# Altium schematic sheet Motors.SchDoc
size A4
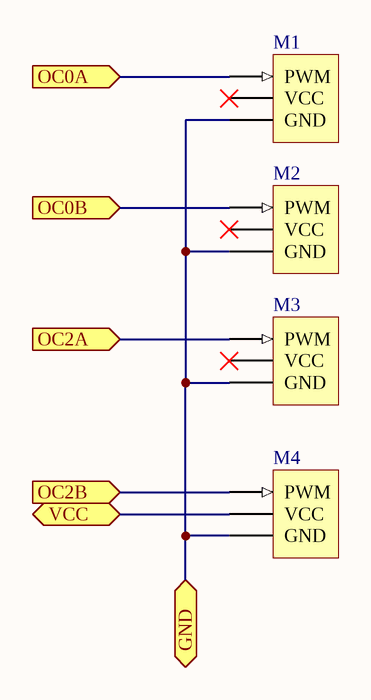
[diagram p0: Motors.SchDoc]

## Parts
M1  Header 3  [HDR1X3]  (value not drawn)
M2  Header 3  [HDR1X3]  (value not drawn)
M3  Header 3  [HDR1X3]  (value not drawn)
M4  Header 3  [HDR1X3]  (value not drawn)

## Ports
GND, OC0A (in), OC0B (in), OC2A (in), OC2B (in), VCC

## Nets
GND: M1.3(GND) M2.3(GND) M3.3(GND) M4.3(GND) ; port GND
OC0A: M1.1(PWM) ; port OC0A
OC0B: M2.1(PWM) ; port OC0B
OC2A: M3.1(PWM) ; port OC2A
OC2B: M4.1(PWM) ; port OC2B
VCC: M4.2(VCC) ; port VCC

Not connected (* = marked no-connect by the designer): M1 2(VCC)*; M2 2(VCC)*; M3 2(VCC)*

## Library data of the parts
M1-M4 = Header 3: Header, 3-Pin; LatestRevisionDate: 17-Jul-2002; LatestRevisionNote: Re-released for DXP Platform.; Publisher: Altium Limited